# Altium project DryBox_V1-1.PrjPcb
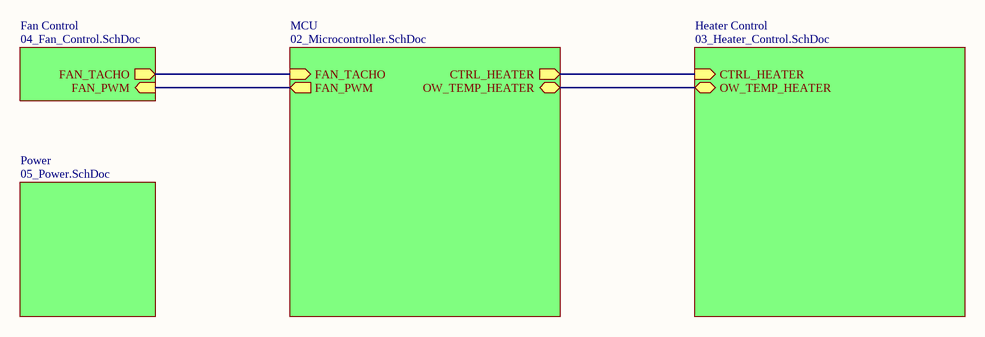
[diagram p0: 01_Top.SchDoc]
revision: 1.0; sk_ProjectName: DIY Dry Box
2 sheets, 18 parts. Net scope: hierarchical (ports join the sheet entries above them; power ports are global).
Board file: DryBoxv1-1.PcbDoc
Sheets:
  01_Top.SchDoc
    Power = 05_Power.SchDoc

## Sheet 01_Top.SchDoc
size A4; Author: Sasa Karanovic; Organization: Altium Limited; sk_Title: Block diagram; DocumentNumber: 1; Revision: 1.0; SheetNumber: 1; SheetTotal: 5

### Sub-sheets
Fan Control = 04_Fan_Control.SchDoc (file not in this document): FAN_TACHO (out), FAN_PWM (in)
Heater Control = 03_Heater_Control.SchDoc (file not in this document): CTRL_HEATER (in), OW_TEMP_HEATER (bidir)
MCU = 02_Microcontroller.SchDoc (file not in this document): CTRL_HEATER (out), FAN_TACHO (in), FAN_PWM (out), OW_TEMP_HEATER (bidir)
Power = 05_Power.SchDoc: no entries

### Nets
(unnamed): sheet MCU/CTRL_HEATER, sheet Heater Control/CTRL_HEATER
(unnamed): sheet MCU/FAN_TACHO, sheet Fan Control/FAN_TACHO
(unnamed): sheet MCU/FAN_PWM, sheet Fan Control/FAN_PWM
(unnamed): sheet MCU/OW_TEMP_HEATER, sheet Heater Control/OW_TEMP_HEATER

### Notes on the sheet
- Page
- Title
- www.SasaKaranovic.com <http://www.SasaKaranovic.com>
- of

## Sheet 05_Power.SchDoc
size A4; Author: Sasa Karanovic; Organization: Altium Limited; sk_Title: Power; DocumentNumber: 1; SheetNumber: 5; SheetTotal: 5
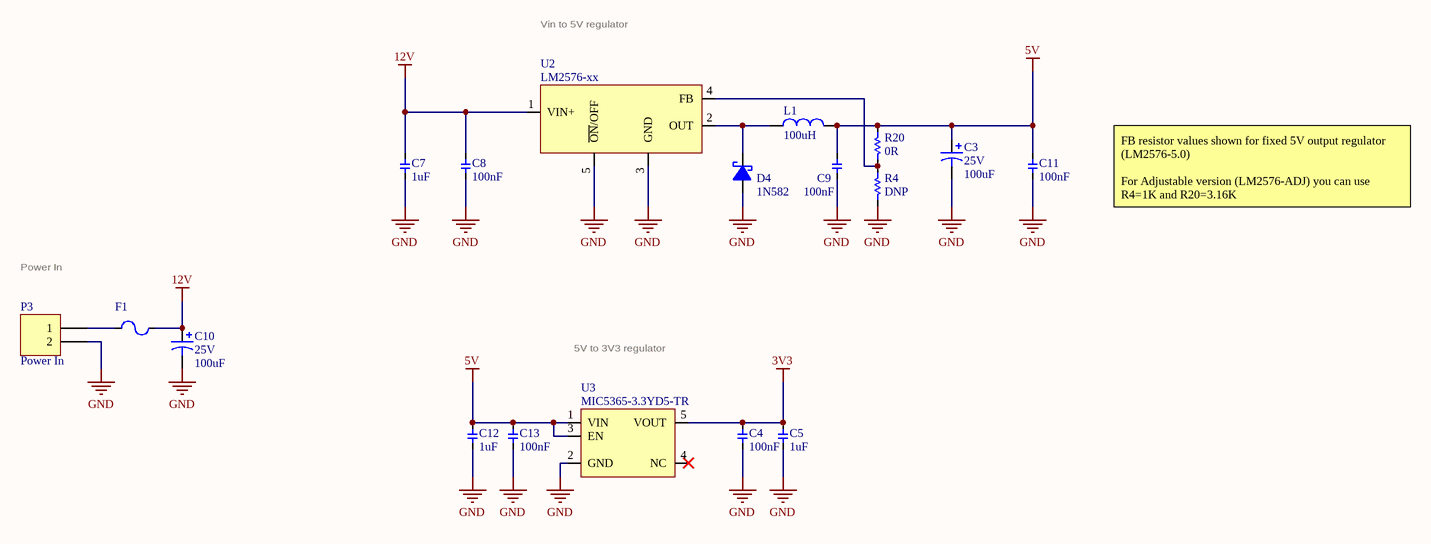
[diagram p1: 05_Power.SchDoc]

### Parts
C3  25V  value 100uF  [Electrolytic Cap 2.54mm]
C4  value 100nF  [0603 - CAP]  (hidden comment: Cap)
C5  value 1uF  [0603 - CAP]  (hidden comment: Cap)
C7  value 1uF  [0603 - CAP]  (hidden comment: Cap)
C8  value 100nF  [0603 - CAP]  (hidden comment: Cap)
C9  value 100nF  [0603 - CAP]  (hidden comment: Cap)
C10  25V  value 100uF  [Electrolytic Cap 2.54mm]
C11  value 100nF  [0603 - CAP]  (hidden comment: Cap)
C12  value 1uF  [0603 - CAP]  (hidden comment: Cap)
C13  value 100nF  [0603 - CAP]  (hidden comment: Cap)
D4  1N582  [SOD123F]
F1  Fuse Thermal  [1812F]  (value not drawn)
L1  value 100uH  [IND_TH_SMD]  (hidden comment: Inductor)
P3  Power In  [Header 2x1]
R4  value DNP  [0603 - HS]  (hidden comment: Res)  (no BOM)
R20  value 0R  [0603 - HS]  (hidden comment: Res)
U2  LM2576-xx  [TO263-5]
U3  MIC5365-3.3YD5-TR  [SOT-23-5 - duplicate]

### Nets
3V3: C4.2 C5.2 U3.5(VOUT)
5V: C3.1 C9.2 C11.2 C12.2 C13.2 L1.2 R20.2 U3.1(VIN) U3.3(EN)
12V: C7.2 C8.2 C10.1 F1.1 U2.1(VIN+)
GND: C3.2 C4.1 C5.1 C7.1 C8.1 C9.1 C10.2 C11.1 C12.1 C13.1 D4.A P3.2 R4.1 U2.3(GND) U2.5(~{ON}/OFF) U3.2(GND)
NetD4_K: D4.K L1.1 U2.2(OUT)
NetF1_2: F1.2 P3.1
NetR4_2: R4.2 R20.1 U2.4(FB)

Not connected (* = marked no-connect by the designer): U3 4(NC)*

### Notes on the sheet
- Vin to 5V regulator
- FB resistor values shown for fixed 5V output regulator (LM2576-5.0)
  For Adjustable version (LM2576-ADJ) you can use R4=1K and R20=3.16K
- Power In
- 5V to 3V3 regulator
- Page
- Title
- www.SasaKaranovic.com <http://www.SasaKaranovic.com>
- of

### Library data of the parts
C3 C10 = Cap Electrolytic: Polarized Capacitor (Axial); Manufacturer: Würth Elektronik; Manufacturer Part Number: 860160674021; Distributor: DigiKey; Distributor Part Number: 732-9599-1-ND
C4 C8 C9 C11 C13 = Cap: Capacitor; Manufacturer: Samsung Electro-Mechanics; Manufacturer Part Number: CL10B103KB8NNNC; Distributor Part Number: 1276-1009-1-ND; Distributor: DigiKey
C5 C7 C12 = Cap: Capacitor; Manufacturer: Samsung Electro-Mechanics; Manufacturer Part Number: CL10A105KB8NNNC; Distributor Part Number: 1276-1860-1-ND; Distributor: DigiKey
D4 = Diode Schotky: Manufacturer: Nexperia USA Inc.; Manufacturer Part Number: PMEG6010CEH,115; Distributor: DigiKey; Distributor Part Number: 1727-3848-1-ND
F1 = Fuse Thermal: Thermal Fuse; Manufacturer: Bourns Inc.; Manufacturer Part Number: SF-1206SP200-2; Distributor: DigiKey; Distributor Part Number: SF-1206SP200-2CT-ND
L1 = Inductor: Manufacturer: TDK Corporation; Manufacturer Part Number: VLS6045AF-101M; Distributor: DigiKey; Distributor Part Number: 445-180842-1-ND
P3 = Header 2: Header, 2-Pin
R4 = Res: Resistor; Distributor: DigiKey
R20 = Res: Resistor; Manufacturer: Stackpole Electronics Inc; Manufacturer Part Number: RMCF0603ZT0R00; Distributor: DigiKey; Distributor Part Number: RMCF0603ZT0R00CT-ND
U2 = LM2576-xx: Switching mode regulator [ 3v3, 5v, 12v and ADJ ]; Manufacturer: Texas Instruments; Manufacturer Part Number: LM2576S-5.0/NOPB; Distributor: DigiKey; Distributor Part Number: LM2576S-5.0/NOPB-ND
U3 = MIC5365-1.8YD5-TR: IC REG LIN 3.3V 150MA TSOT23-5; Manufacturer: Microchip Technology; Manufacturer Part Number: MIC5365-3.3YD5-TR; Distributor: DigiKey; Distributor Part Number: 576-4085-1-ND